# Altium schematic sheet RS485.SchDoc
size A; SheetNumber: 7; SheetTotal: 9
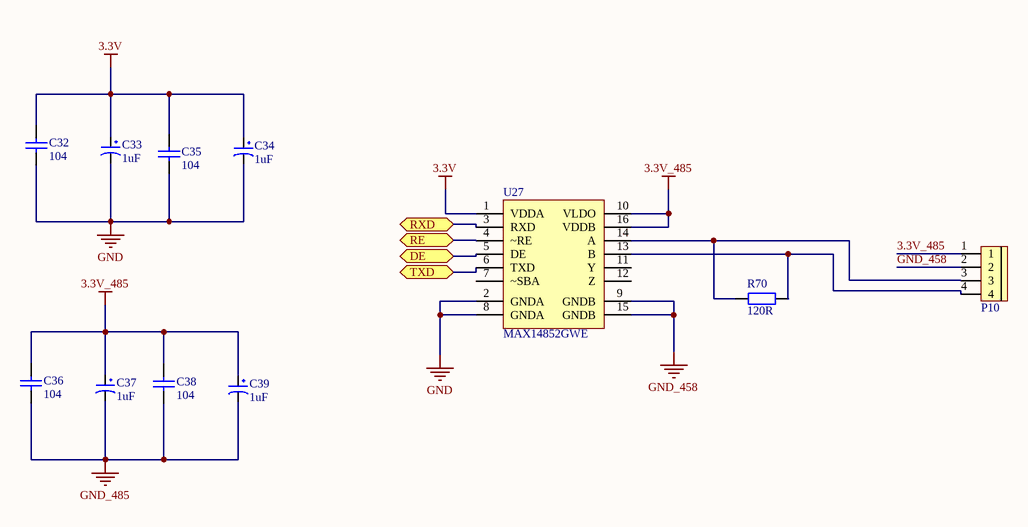
[diagram p0: RS485.SchDoc]

## Parts
C32  104  [tu 0805]
C33  1uF  [tu tantalum smd6032]
C34  1uF  [tu tantalum smd6032]
C35  104  [tu 0805]
C36  104  [tu 0805]
C37  1uF  [tu tantalum smd6032]
C38  104  [tu 0805]
C39  1uF  [tu tantalum smd6032]
P10  CON 4 EDG5.08  [CON 4 4EDG5.08]  (value not drawn)
R70  120R  [tro smd 0805]
U27  MAX14852GWE  [SOICW16_50_440_25X76_SMT]

## Ports
DE (bidir), RE (bidir), RXD (bidir), TXD (bidir)

## Nets
3.3V: C32.1 C33.1 C34.1 C35.1 U27.1(VDDA)
3.3V_485: C36.1 C37.1 C38.1 C39.1 P10.1 U27.10(VLDO) U27.16(VDDB)
GND: C32.2 C33.2 C34.2 C35.2 U27.2(GNDA) U27.8(GNDA)
GND_458: P10.2 U27.9(GNDB) U27.15(GNDB)
GND_485: C36.2 C37.2 C38.2 C39.2
DE: U27.5(DE) ; port DE
RE: U27.4(~RE) ; port RE
RXD: U27.3(RXD) ; port RXD
TXD: U27.6(TXD) ; port TXD
NetP10_3: P10.3 R70.1 U27.14(A)
NetP10_4: P10.4 R70.2 U27.13(B)

Not connected (* = marked no-connect by the designer): U27 7(~SBA) 11(Y) 12(Z)

## Library data of the parts
C32 C35 C36 C38 = Tu 0805 104 50V 10%: Dán; Don_Vi: Con; So_Chan: 2; Ten_Linh_Kien: Tụ 0805 104-100nF 10% 50V; Ma_Hang: MH004551; Chung_Loai: Dán; Kieu_Chan: *
C33 C34 C37 C39 = Tu tantalum 1uF 50V SMD6032: Dán; Don_Vi: Con; So_Chan: 2; Ten_Linh_Kien: Tụ tantalum 105T-1uF 50V SMD6032; Ma_Hang: MH008400; Chung_Loai: Dán; Kieu_Chan: *
P10 = CON 4 EDG5.08: Cắm; Ten_Linh_Kien: CON 4 2EDG5.08-4P 5.08MM ( Xanh Cong); Ma_Hang: MH000979; Don_Vi: Con; Ghi_Chu: *; Kieu_Chan: *; Chung_Loai: Cắm
R70 = Tro 0805 5% 120R: Dán; Don_Vi: Con; So_Chan: 2; Ten_Linh_Kien: Trở 0805 5% 120R; Ma_Hang: MH005253; Chung_Loai: Dán; Kieu_Chan: *
U27 = IC_MAX14852GWE: 1/1 Transceiver Full RS422, RS485 16-SOIC; Manufacturer: Maxim; Manufacturer Part Number: MAX14852GWE+T; Alternate Part Number-1: NA; Case/Package: SOICW16; Supplier-1: Mouser; Supplier Part Number-1: 700-MAX14852GWE+T